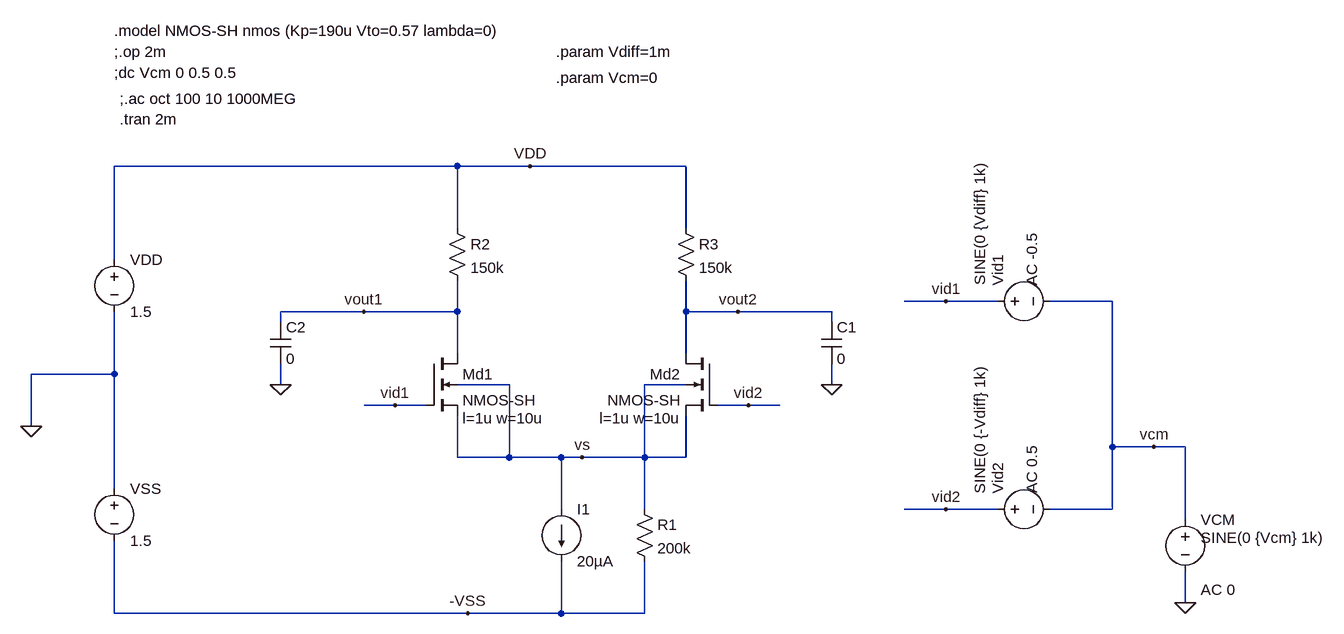
[diagram p0: schematic diff_pair_res.asc]
diff_pair_res.asc, the LTspice schematic file:
Version 4
SHEET 1 1092 680
WIRE -672 -64 -1200 -64
WIRE -560 -64 -672 -64
WIRE -320 -64 -560 -64
WIRE -672 32 -672 -64
WIRE -320 32 -320 -64
WIRE -1200 80 -1200 -64
WIRE 80 144 16 144
WIRE 160 144 80 144
WIRE 336 144 240 144
WIRE -816 160 -944 160
WIRE -672 160 -672 112
WIRE -672 160 -816 160
WIRE -320 160 -320 112
WIRE -240 160 -320 160
WIRE -96 160 -240 160
WIRE -944 176 -944 160
WIRE -96 176 -96 160
WIRE -672 224 -672 160
WIRE -320 224 -320 160
WIRE -1200 256 -1200 160
WIRE -1200 256 -1328 256
WIRE -944 272 -944 240
WIRE -592 272 -672 272
WIRE -320 272 -384 272
WIRE -96 272 -96 240
WIRE -768 304 -816 304
WIRE -720 304 -768 304
WIRE -224 304 -272 304
WIRE -176 304 -224 304
WIRE -1328 336 -1328 256
WIRE 336 368 336 144
WIRE 400 368 336 368
WIRE 448 368 400 368
WIRE -672 384 -672 320
WIRE -592 384 -592 272
WIRE -592 384 -672 384
WIRE -512 384 -592 384
WIRE -480 384 -512 384
WIRE -384 384 -384 272
WIRE -384 384 -480 384
WIRE -320 384 -320 320
WIRE -320 384 -384 384
WIRE -1200 432 -1200 256
WIRE -512 464 -512 384
WIRE -384 464 -384 384
WIRE 80 464 16 464
WIRE 160 464 80 464
WIRE 336 464 336 368
WIRE 336 464 240 464
WIRE 448 480 448 368
WIRE 448 608 448 560
WIRE -1200 624 -1200 512
WIRE -656 624 -1200 624
WIRE -512 624 -512 544
WIRE -512 624 -656 624
WIRE -384 624 -384 544
WIRE -384 624 -512 624
FLAG -1328 336 0
FLAG 448 608 0
FLAG -768 304 vid1
FLAG -224 304 vid2
FLAG 80 144 vid1
FLAG 80 464 vid2
FLAG 400 368 vcm
FLAG -96 272 0
FLAG -240 160 vout2
FLAG -560 -64 VDD
FLAG -656 624 -VSS
FLAG -944 272 0
FLAG -816 160 vout1
FLAG -480 384 vs
DATAFLAG -800 304 ""
DATAFLAG -656 384 ""
SYMBOL nmos4 -720 224 R0
WINDOW 123 56 100 Left 2
SYMATTR Value2 l=1u w=10u
SYMATTR InstName Md1
SYMATTR Value NMOS-SH
SYMBOL voltage -1200 416 R0
WINDOW 123 0 0 Left 2
WINDOW 39 0 0 Left 2
SYMATTR InstName VSS
SYMATTR Value 1.5
SYMBOL nmos4 -272 224 M0
WINDOW 123 56 100 Left 2
SYMATTR Value2 l=1u w=10u
SYMATTR InstName Md2
SYMATTR Value NMOS-SH
SYMBOL voltage -1200 64 R0
WINDOW 123 0 0 Left 2
WINDOW 39 0 0 Left 2
SYMATTR InstName VDD
SYMATTR Value 1.5
SYMBOL voltage 448 464 R0
WINDOW 123 24 124 Left 2
WINDOW 39 0 0 Left 2
WINDOW 3 24 44 Left 2
SYMATTR Value2 AC 0
SYMATTR Value SINE(0 {Vcm} 1k)
SYMATTR InstName VCM
SYMBOL voltage 144 144 R270
WINDOW 123 24 68 Left 2
WINDOW 39 0 0 Left 2
WINDOW 3 24 -12 Left 2
SYMATTR Value2 AC -0.5
SYMATTR Value SINE(0 {Vdiff} 1k)
SYMATTR InstName Vid1
SYMBOL voltage 144 464 R270
WINDOW 123 24 68 Left 2
WINDOW 39 0 0 Left 2
WINDOW 3 24 -12 Left 2
SYMATTR Value2 AC 0.5
SYMATTR Value SINE(0 {-Vdiff} 1k)
SYMATTR InstName Vid2
SYMBOL cap -112 176 R0
SYMATTR InstName C1
SYMATTR Value 0
SYMBOL res -688 16 R0
SYMATTR InstName R2
SYMATTR Value 150k
SYMBOL res -336 16 R0
SYMATTR InstName R3
SYMATTR Value 150k
SYMBOL current -512 464 R0
WINDOW 123 0 0 Left 2
WINDOW 39 0 0 Left 2
SYMATTR InstName I1
SYMATTR Value 20µA
SYMBOL cap -960 176 R0
SYMATTR InstName C2
SYMATTR Value 0
SYMBOL res -400 448 R0
SYMATTR InstName R1
SYMATTR Value 200k
TEXT -1200 -272 Left 2 !.model NMOS-SH nmos (Kp=190u Vto=0.57 lambda=0)
TEXT -1200 -208 Left 2 !;dc Vcm 0 0.5 0.5
TEXT -1200 -240 Left 2 !;.op 2m
TEXT -1192 -168 Left 2 !;.ac oct 100 10 1000MEG
TEXT -1192 -136 Left 2 !.tran 2m
TEXT -520 -240 Left 2 !.param Vdiff=1m
TEXT -520 -200 Left 2 !.param Vcm=0

The netlist it stands for:
* diff_pair_res.asc
Md1 vout1 vid1 vs vs NMOS-SH l=1u w=10u
VSS 0 -VSS 1.5
Md2 vout2 vid2 vs vs NMOS-SH l=1u w=10u
VDD VDD 0 1.5
VCM vcm 0 SINE(0 {Vcm} 1k) AC 0
Vid1 vid1 vcm SINE(0 {Vdiff} 1k) AC -0.5
Vid2 vid2 vcm SINE(0 {-Vdiff} 1k) AC 0.5
C1 vout2 0 0
R2 VDD vout1 150k
R3 VDD vout2 150k
I1 vs -VSS 20µA
C2 vout1 0 0
R1 vs -VSS 200k
.model NMOS NMOS
.model PMOS PMOS
.lib standard.mos
.model NMOS-SH nmos (Kp=190u Vto=0.57 lambda=0)
;dc Vcm 0 0.5 0.5
;.op 2m
;.ac oct 100 10 1000MEG
.tran 2m
.param Vdiff=1m
.param Vcm=0
.backanno
.end